# EAGLE design RFID_Reader_v0.1 (EAGLE 9.6.2)
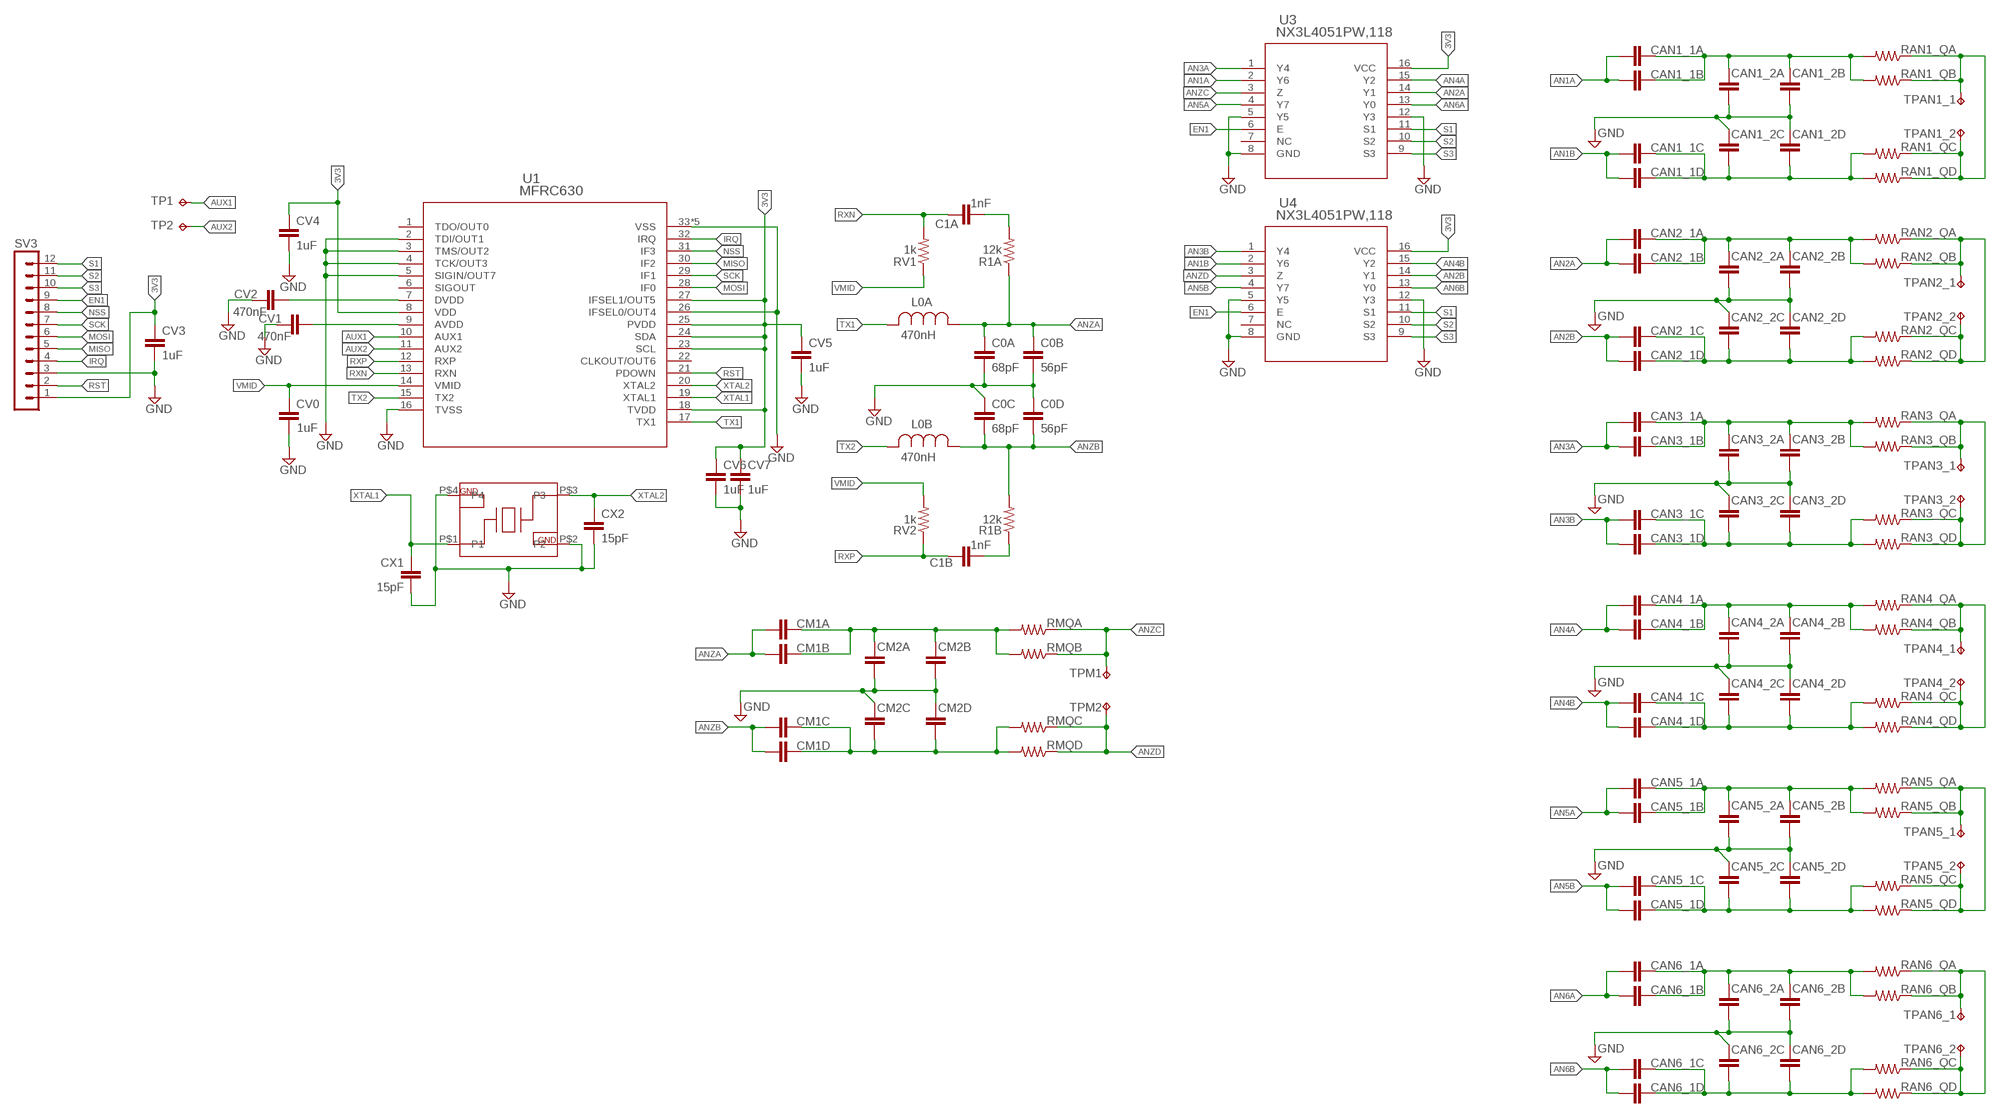
[diagram p0: schematic, sheet 1]

## Parts
C0A  68pF  C-EUC0805  [C0805]
C0B  56pF  C-EUC0805  [C0805]
C0C  68pF  C-EUC0805  [C0805]
C0D  56pF  C-EUC0805  [C0805]
C1A  1nF  C-EUC0805  [C0805]
C1B  1nF  C-EUC0805  [C0805]
CAN1_1A  C-EUC0805  [C0805]
CAN1_1B  C-EUC0805  [C0805]
CAN1_1C  C-EUC0805  [C0805]
CAN1_1D  C-EUC0805  [C0805]
CAN1_2A  C-EUC0805  [C0805]
CAN1_2B  C-EUC0805  [C0805]
CAN1_2C  C-EUC0805  [C0805]
CAN1_2D  C-EUC0805  [C0805]
CAN2_1A  C-EUC0805  [C0805]
CAN2_1B  C-EUC0805  [C0805]
CAN2_1C  C-EUC0805  [C0805]
CAN2_1D  C-EUC0805  [C0805]
CAN2_2A  C-EUC0805  [C0805]
CAN2_2B  C-EUC0805  [C0805]
CAN2_2C  C-EUC0805  [C0805]
CAN2_2D  C-EUC0805  [C0805]
CAN3_1A  C-EUC0805  [C0805]
CAN3_1B  C-EUC0805  [C0805]
CAN3_1C  C-EUC0805  [C0805]
CAN3_1D  C-EUC0805  [C0805]
CAN3_2A  C-EUC0805  [C0805]
CAN3_2B  C-EUC0805  [C0805]
CAN3_2C  C-EUC0805  [C0805]
CAN3_2D  C-EUC0805  [C0805]
CAN4_1A  C-EUC0805  [C0805]
CAN4_1B  C-EUC0805  [C0805]
CAN4_1C  C-EUC0805  [C0805]
CAN4_1D  C-EUC0805  [C0805]
CAN4_2A  C-EUC0805  [C0805]
CAN4_2B  C-EUC0805  [C0805]
CAN4_2C  C-EUC0805  [C0805]
CAN4_2D  C-EUC0805  [C0805]
CAN5_1A  C-EUC0805  [C0805]
CAN5_1B  C-EUC0805  [C0805]
CAN5_1C  C-EUC0805  [C0805]
CAN5_1D  C-EUC0805  [C0805]
CAN5_2A  C-EUC0805  [C0805]
CAN5_2B  C-EUC0805  [C0805]
CAN5_2C  C-EUC0805  [C0805]
CAN5_2D  C-EUC0805  [C0805]
CAN6_1A  C-EUC0805  [C0805]
CAN6_1B  C-EUC0805  [C0805]
CAN6_1C  C-EUC0805  [C0805]
CAN6_1D  C-EUC0805  [C0805]
CAN6_2A  C-EUC0805  [C0805]
CAN6_2B  C-EUC0805  [C0805]
CAN6_2C  C-EUC0805  [C0805]
CAN6_2D  C-EUC0805  [C0805]
CM1A  C-EUC0805  [C0805]
CM1B  C-EUC0805  [C0805]
CM1C  C-EUC0805  [C0805]
CM1D  C-EUC0805  [C0805]
CM2A  C-EUC0805  [C0805]
CM2B  C-EUC0805  [C0805]
CM2C  C-EUC0805  [C0805]
CM2D  C-EUC0805  [C0805]
CV0  1uF  C-EUC0402  [C0402]
CV1  470nF  C-EUC0402  [C0402]
CV2  470nF  C-EUC0402  [C0402]
CV3  1uF  C-EUC0402  [C0402]
CV4  1uF  C-EUC0402  [C0402]
CV5  1uF  C-EUC0402  [C0402]
CV6  1uF  C-EUC0402  [C0402]
CV7  1uF  C-EUC0402  [C0402]
CX1  15pF  C-EUC0402  [C0402]
CX2  15pF  C-EUC0402  [C0402]
L0A  470nH  CE201210-R47JIND_BOURNS_CE201210_C  [IND_BOURNS_CE201210_C]
L0B  470nH  CE201210-R47JIND_BOURNS_CE201210_C  [IND_BOURNS_CE201210_C]
R1A  12k  R-US_R0805  [R0805]
R1B  12k  R-US_R0805  [R0805]
RAN1_QA  R-US_R0805  [R0805]
RAN1_QB  R-US_R0805  [R0805]
RAN1_QC  R-US_R0805  [R0805]
RAN1_QD  R-US_R0805  [R0805]
RAN2_QA  R-US_R0805  [R0805]
RAN2_QB  R-US_R0805  [R0805]
RAN2_QC  R-US_R0805  [R0805]
RAN2_QD  R-US_R0805  [R0805]
RAN3_QA  R-US_R0805  [R0805]
RAN3_QB  R-US_R0805  [R0805]
RAN3_QC  R-US_R0805  [R0805]
RAN3_QD  R-US_R0805  [R0805]
RAN4_QA  R-US_R0805  [R0805]
RAN4_QB  R-US_R0805  [R0805]
RAN4_QC  R-US_R0805  [R0805]
RAN4_QD  R-US_R0805  [R0805]
RAN5_QA  R-US_R0805  [R0805]
RAN5_QB  R-US_R0805  [R0805]
RAN5_QC  R-US_R0805  [R0805]
RAN5_QD  R-US_R0805  [R0805]
RAN6_QA  R-US_R0805  [R0805]
RAN6_QB  R-US_R0805  [R0805]
RAN6_QC  R-US_R0805  [R0805]
RAN6_QD  R-US_R0805  [R0805]
RMQA  R-US_R0805  [R0805]
RMQB  R-US_R0805  [R0805]
RMQC  R-US_R0805  [R0805]
RMQD  R-US_R0805  [R0805]
RV1  1k  R-US_R0805  [R0805]
RV2  1k  R-US_R0805  [R0805]
SV3  MA12-1  [MA12-1]
TP1  TPTP10R  [TP10R]
TP2  TPTP10R  [TP10R]
TPAN1_1  TPTP10R  [TP10R]
TPAN1_2  TPTP10R  [TP10R]
TPAN2_1  TPTP10R  [TP10R]
TPAN2_2  TPTP10R  [TP10R]
TPAN3_1  TPTP10R  [TP10R]
TPAN3_2  TPTP10R  [TP10R]
TPAN4_1  TPTP10R  [TP10R]
TPAN4_2  TPTP10R  [TP10R]
TPAN5_1  TPTP10R  [TP10R]
TPAN5_2  TPTP10R  [TP10R]
TPAN6_1  TPTP10R  [TP10R]
TPAN6_2  TPTP10R  [TP10R]
TPM1  TPTP10R  [TP10R]
TPM2  TPTP10R  [TP10R]
U1  MFRC630  MFRC63002HN,118HVQFN32_SOT617-1_NXP-M  [HVQFN32_SOT617-1_NXP-M]
U2  E3SB27  E3SB27E0X000VEE3SB27E0X000VE  [DFN320X250X75-4N]
U3  NX3L4051PW,118  NX3L4051PW,118TSSOP16_NXP-M  [TSSOP16_NXP-M]
U4  NX3L4051PW,118  NX3L4051PW,118TSSOP16_NXP-M  [TSSOP16_NXP-M]

## Nets
3V3: CV3.1 CV4.1 CV5.1 CV6.1 CV7.1 SV3.1 U1.8(VDD) U1.18(TVDD) U1.23(SCL) U1.24(SDA) U1.25(PVDD) U1.27(IFSEL1/OUT5) U3.16(VCC) U4.16(VCC)
AN1A: CAN1_1A.2 CAN1_1B.2 U3.2(Y6)
AN1B: CAN1_1C.2 CAN1_1D.2 U4.2(Y6)
AN2A: CAN2_1A.2 CAN2_1B.2 U3.14(Y1)
AN2B: CAN2_1C.2 CAN2_1D.2 U4.14(Y1)
AN3A: CAN3_1A.2 CAN3_1B.2 U3.1(Y4)
AN3B: CAN3_1C.2 CAN3_1D.2 U4.1(Y4)
AN4A: CAN4_1A.2 CAN4_1B.2 U3.15(Y2)
AN4B: CAN4_1C.2 CAN4_1D.2 U4.15(Y2)
AN5A: CAN5_1A.2 CAN5_1B.2 U3.4(Y7)
AN5B: CAN5_1C.2 CAN5_1D.2 U4.4(Y7)
AN6A: CAN6_1A.2 CAN6_1B.2 U3.13(Y0)
AN6B: CAN6_1C.2 CAN6_1D.2 U4.13(Y0)
ANZA: C0A.1 C0B.1 CM1A.2 CM1B.2 L0A.1 R1A.1
ANZB: C0C.2 C0D.2 CM1C.2 CM1D.2 L0B.1 R1B.2
ANZC: RMQA.1 RMQB.1 TPM1.TP U3.3(Z)
ANZD: RMQC.1 RMQD.1 TPM2.TP U4.3(Z)
AUX1: TP1.TP U1.10(AUX1)
AUX2: TP2.TP U1.11(AUX2)
EN1: SV3.9 U3.6(E) U4.6(E)
GND: C0A.2 C0B.2 C0C.1 C0D.1 CAN1_2A.2 CAN1_2B.2 CAN1_2C.1 CAN1_2D.1 CAN2_2A.2 CAN2_2B.2 CAN2_2C.1 CAN2_2D.1 CAN3_2A.2 CAN3_2B.2 CAN3_2C.1 CAN3_2D.1 CAN4_2A.2 CAN4_2B.2 CAN4_2C.1 CAN4_2D.1 CAN5_2A.2 CAN5_2B.2 CAN5_2C.1 CAN5_2D.1 CAN6_2A.2 CAN6_2B.2 CAN6_2C.1 CAN6_2D.1 CM2A.2 CM2B.2 CM2C.1 CM2D.1 CV0.2 CV1.2 CV2.2 CV3.2 CV4.2 CV5.2 CV6.2 CV7.2 CX1.2 CX2.2 SV3.3 U1.2(TDI/OUT1) U1.3(TMS/OUT2) U1.4(TCK/OUT3) U1.5(SIGIN/OUT7) U1.16(TVSS) U1.26(IFSEL0/OUT4) U1.33(VSS) U1.P$1(VSS) U1.P$2(VSS) U1.P$3(VSS) U1.P$4(VSS) U2.P$2(P2) U2.P$4(P4) U3.5(Y5) U3.8(GND) U3.12(Y3) U4.5(Y5) U4.8(GND) U4.12(Y3)
IRQ: SV3.4 U1.32(IRQ)
MISO: SV3.5 U1.30(IF2)
MOSI: SV3.6 U1.28(IF0)
N$1: CM1C.1 CM1D.1 CM2C.2 CM2D.2 RMQC.2 RMQD.2
N$2: C1A.2 R1A.2
N$3: CM1A.1 CM1B.1 CM2A.1 CM2B.1 RMQA.2 RMQB.2
N$4: CAN2_1C.1 CAN2_1D.1 CAN2_2C.2 CAN2_2D.2 RAN2_QC.2 RAN2_QD.2
N$5: CAN2_1A.1 CAN2_1B.1 CAN2_2A.1 CAN2_2B.1 RAN2_QA.2 RAN2_QB.2
N$6: RAN2_QA.1 RAN2_QB.1 RAN2_QC.1 RAN2_QD.1 TPAN2_1.TP TPAN2_2.TP
N$7: CAN1_1C.1 CAN1_1D.1 CAN1_2C.2 CAN1_2D.2 RAN1_QC.2 RAN1_QD.2
N$8: CAN1_1A.1 CAN1_1B.1 CAN1_2A.1 CAN1_2B.1 RAN1_QA.2 RAN1_QB.2
N$9: RAN1_QA.1 RAN1_QB.1 RAN1_QC.1 RAN1_QD.1 TPAN1_1.TP TPAN1_2.TP
N$10: CAN3_1C.1 CAN3_1D.1 CAN3_2C.2 CAN3_2D.2 RAN3_QC.2 RAN3_QD.2
N$11: CAN3_1A.1 CAN3_1B.1 CAN3_2A.1 CAN3_2B.1 RAN3_QA.2 RAN3_QB.2
N$12: RAN3_QA.1 RAN3_QB.1 RAN3_QC.1 RAN3_QD.1 TPAN3_1.TP TPAN3_2.TP
N$13: CAN4_1C.1 CAN4_1D.1 CAN4_2C.2 CAN4_2D.2 RAN4_QC.2 RAN4_QD.2
N$14: CAN4_1A.1 CAN4_1B.1 CAN4_2A.1 CAN4_2B.1 RAN4_QA.2 RAN4_QB.2
N$15: RAN4_QA.1 RAN4_QB.1 RAN4_QC.1 RAN4_QD.1 TPAN4_1.TP TPAN4_2.TP
N$16: CAN5_1C.1 CAN5_1D.1 CAN5_2C.2 CAN5_2D.2 RAN5_QC.2 RAN5_QD.2
N$17: CAN5_1A.1 CAN5_1B.1 CAN5_2A.1 CAN5_2B.1 RAN5_QA.2 RAN5_QB.2
N$19: C1B.2 R1B.1
N$21: RAN5_QA.1 RAN5_QB.1 RAN5_QC.1 RAN5_QD.1 TPAN5_1.TP TPAN5_2.TP
N$22: CAN6_1C.1 CAN6_1D.1 CAN6_2C.2 CAN6_2D.2 RAN6_QC.2 RAN6_QD.2
N$23: CAN6_1A.1 CAN6_1B.1 CAN6_2A.1 CAN6_2B.1 RAN6_QA.2 RAN6_QB.2
N$24: RAN6_QA.1 RAN6_QB.1 RAN6_QC.1 RAN6_QD.1 TPAN6_1.TP TPAN6_2.TP
N$26: CV2.1 U1.7(DVDD)
N$28: CV1.1 U1.9(AVDD)
NSS: SV3.8 U1.31(IF3)
RST: SV3.2 U1.21(PDOWN)
RXN: C1A.1 RV1.2 U1.13(RXN)
RXP: C1B.1 RV2.1 U1.12(RXP)
S1: SV3.12 U3.11(S1) U4.11(S1)
S2: SV3.11 U3.10(S2) U4.10(S2)
S3: SV3.10 U3.9(S3) U4.9(S3)
SCK: SV3.7 U1.29(IF1)
TX1: L0A.2 U1.17(TX1)
TX2: L0B.2 U1.15(TX2)
VMID: CV0.1 RV1.1 RV2.2 U1.14(VMID)
XTAL1: CX1.1 U1.19(XTAL1) U2.P$1(P1)
XTAL2: CX2.1 U1.20(XTAL2) U2.P$3(P3)
Unconnected: U1.1(TDO/OUT0) U1.6(SIGOUT) U1.22(CLKOUT/OUT6) U3.7(NC) U4.7(NC)

## Library data of the parts
C0A C0B C0C C0D C1A C1B CAN1_1A CAN1_1B CAN1_1C CAN1_1D CAN1_2A CAN1_2B CAN1_2C CAN1_2D CAN2_1A CAN2_1B CAN2_1C CAN2_1D CAN2_2A CAN2_2B CAN2_2C CAN2_2D CAN3_1A CAN3_1B CAN3_1C CAN3_1D CAN3_2A CAN3_2B CAN3_2C CAN3_2D CAN4_1A CAN4_1B CAN4_1C CAN4_1D CAN4_2A CAN4_2B CAN4_2C CAN4_2D CAN5_1A CAN5_1B CAN5_1C CAN5_1D CAN5_2A CAN5_2B CAN5_2C CAN5_2D CAN6_1A CAN6_1B CAN6_1C CAN6_1D CAN6_2A CAN6_2B CAN6_2C CAN6_2D CM1A CM1B CM1C CM1D CM2A CM2B CM2C CM2D CV0 CV1-CV7 CX1 CX2 = rcl:C-EU: CAPACITOR, European symbol; SPICEPREFIX: C
L0A L0B = CE201210-R47J:CE201210-R47J; COPYRIGHT: Copyright (C) 2024 Ultra Librarian. All rights reserved.; MANUFACTURER_PART_NUMBER: CE201210-R47J; MFR_NAME: Bourns Electronics
R1A R1B RAN1_QA RAN1_QB RAN1_QC RAN1_QD RAN2_QA RAN2_QB RAN2_QC RAN2_QD RAN3_QA RAN3_QB RAN3_QC RAN3_QD RAN4_QA RAN4_QB RAN4_QC RAN4_QD RAN5_QA RAN5_QB RAN5_QC RAN5_QD RAN6_QA RAN6_QB RAN6_QC RAN6_QD RMQA RMQB RMQC RMQD RV1 RV2 = rcl:R-US_: RESISTOR, American symbol; SPICEPREFIX: R
SV3 = con-lstb:MA12-1: PIN HEADER; OC_FARNELL: unknown; OC_NEWARK: unknown
TP1 TP2 TPAN1_1 TPAN1_2 TPAN2_1 TPAN2_2 TPAN3_1 TPAN3_2 TPAN4_1 TPAN4_2 TPAN5_1 TPAN5_2 TPAN6_1 TPAN6_2 TPM1 TPM2 = testpad:TP: Test pad
U1 = MFRC630:MFRC63002HN,118; COPYRIGHT: Copyright (C) 2024 Ultra Librarian. All rights reserved.; MANUFACTURER_PART_NUMBER: MFRC63002HN,118; MFR_NAME: NXP
U2 = E3SB27E0X000VE:E3SB27E0X000VE
U3 U4 = NX3L4051PW,118:NX3L4051PW,118; COPYRIGHT: Copyright (C) 2024 Ultra Librarian. All rights reserved.; MANUFACTURER_PART_NUMBER: NX3L4051PW,118; MFR_NAME: NXP

## Board
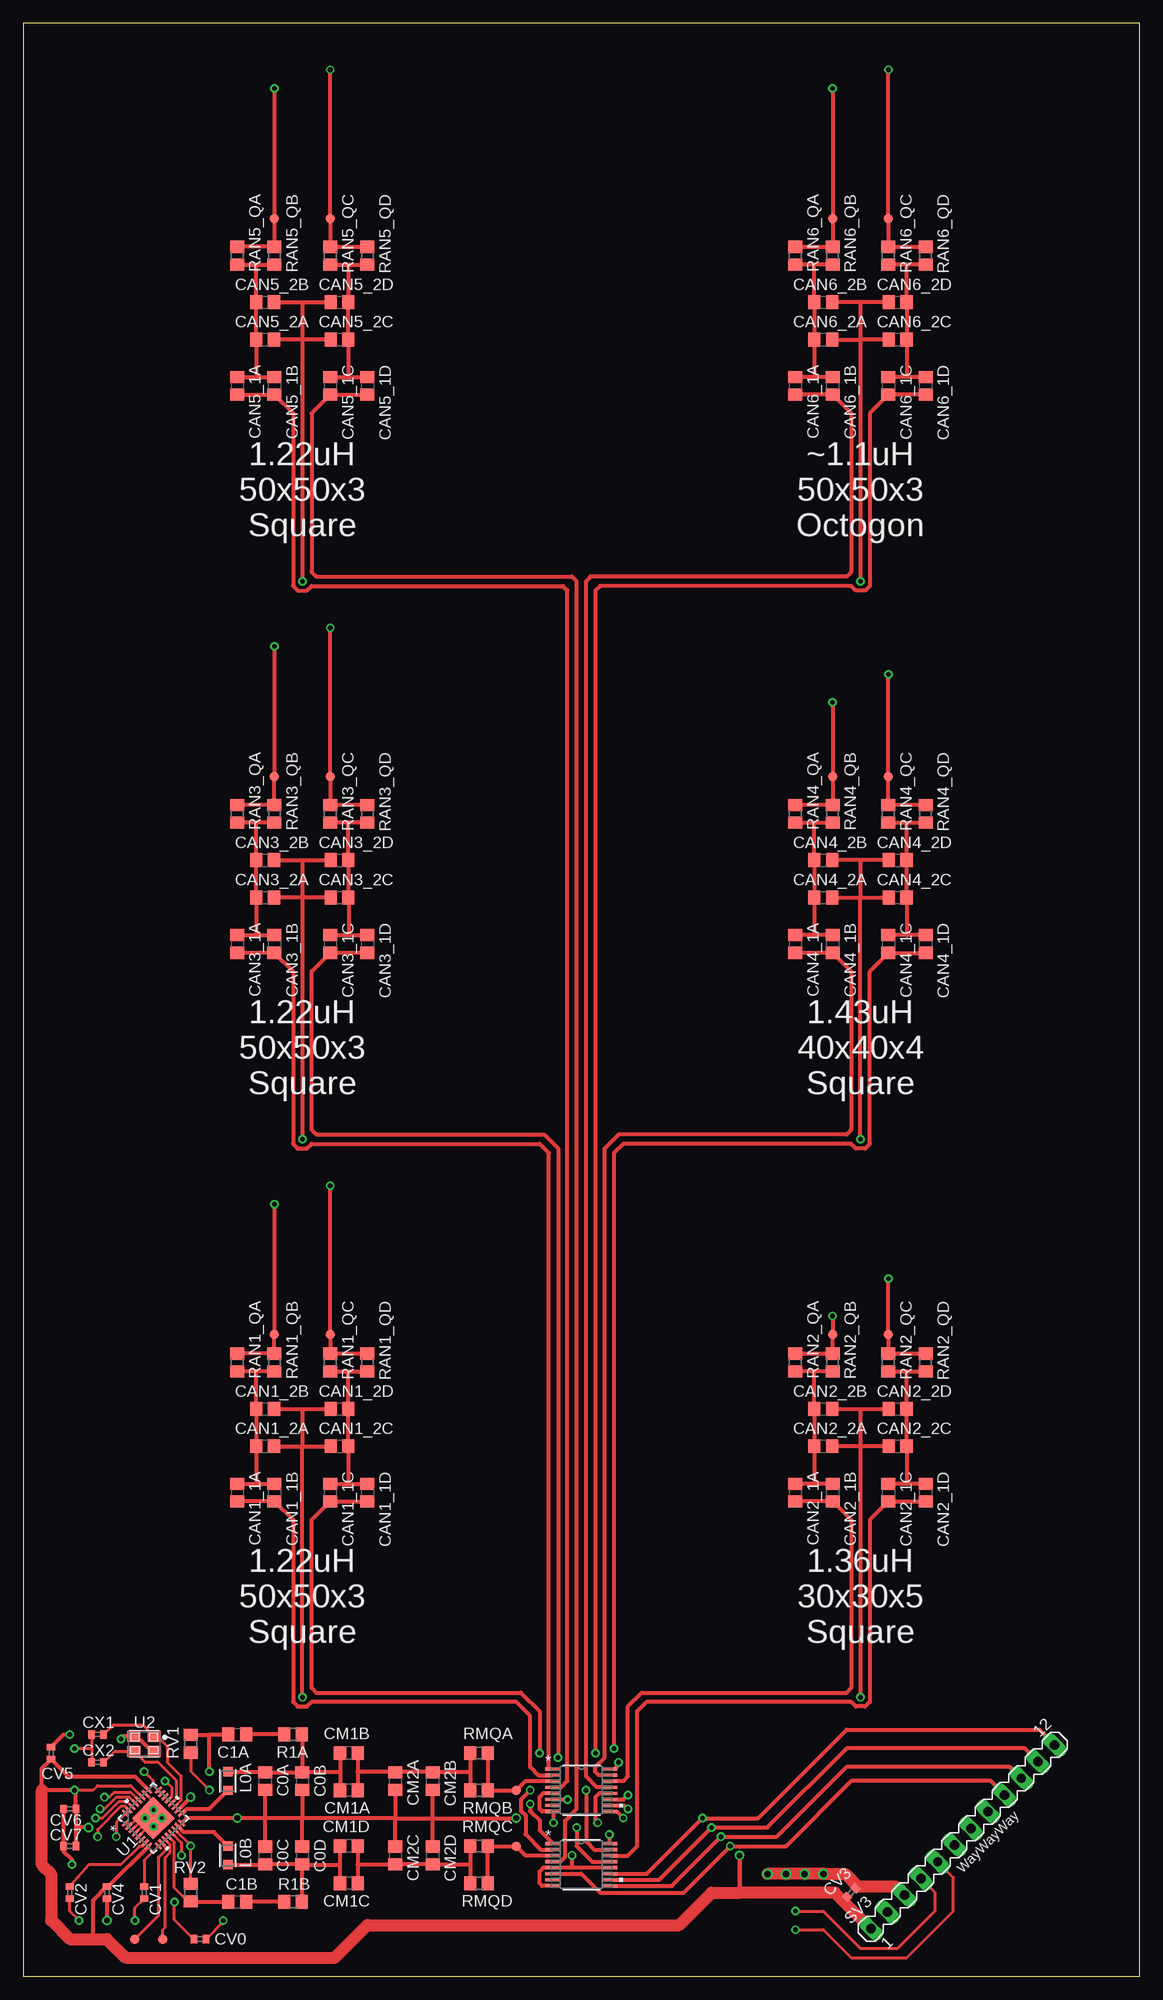
[diagram p1: board, top side]
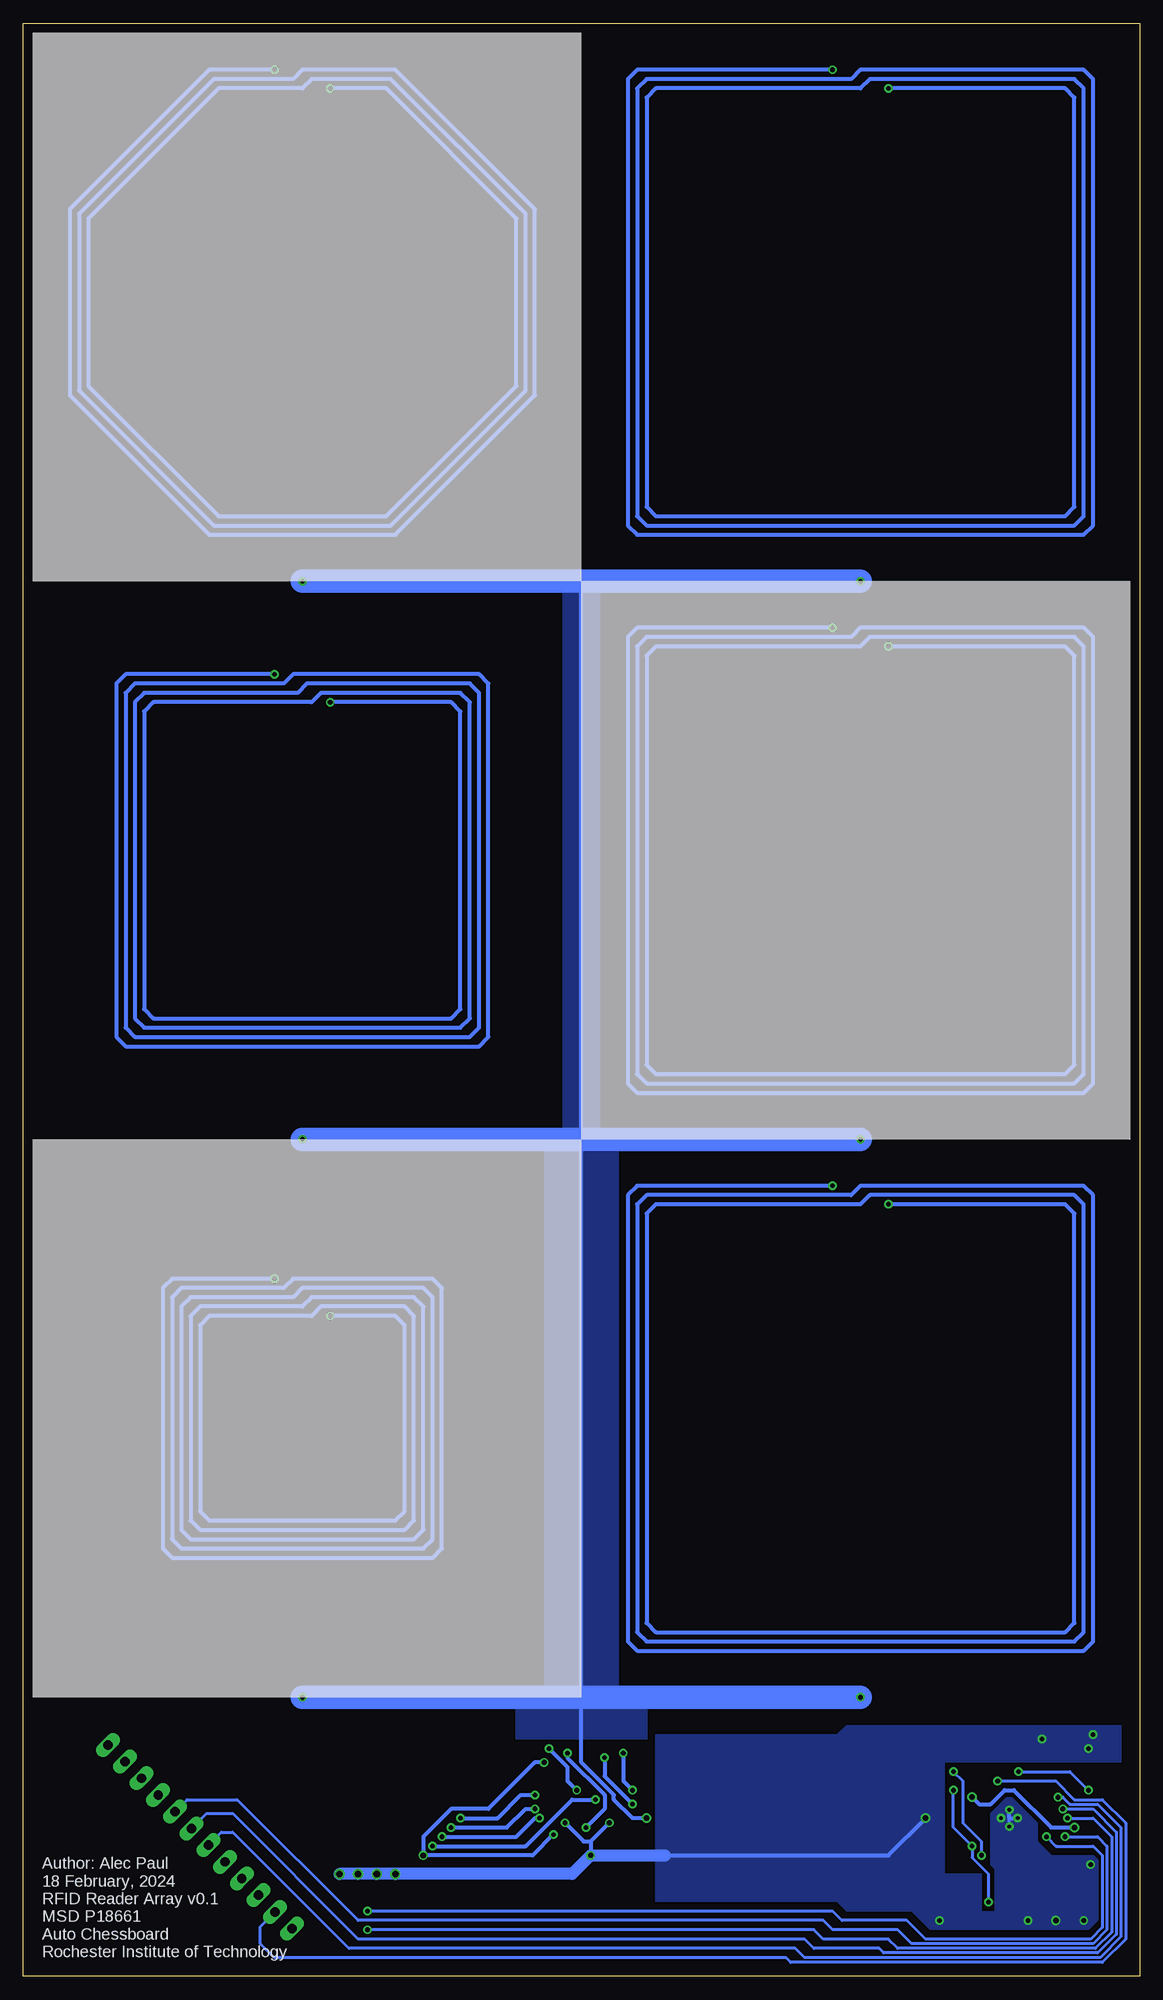
[diagram p2: board, bottom side, seen from below]

Size 120 x 210 mm. Coordinates in mm from the lower left corner, seen from the top.
Outline: 0,0 120,0 120,210 0,210 0,0
Copper layers (1*16): Top 0.035mm / dielectric 1.5mm / Bottom 0.035mm
Design rules "default *": minimum track width 4mil, minimum drill 0.35mm, track to track 4mil, track to pad 4mil, pad to pad 4mil, via to via 4mil, smd to smd 4mil, copper to edge 40mil, drill to drill 6mil, minimum pad ring 10mil, minimum via ring 8mil, stop-mask expansion 4mil, vias tented up to drill 0mil, thermal gap 10mil

### Footprints (pad centres in the part's own frame; a part is rotated, then mirrored left to right if it is on the bottom)
C0805 = smd 1.3 x 1.5: 1 -0.95,0; 2 0.95,0
C0402 = smd 0.7 x 0.9: 1 -0.65,0; 2 0.65,0
IND_BOURNS_CE201210_C = smd 1.003 x 0.991: 1 -0.997,0; 2 0.997,0
R0805 = smd 1.3 x 1.5: 1 -0.95,0; 2 0.95,0
MA12-1 = drill 1.016 long: 1 -13.97,0; 2 -11.43,0; 3 -8.89,0; 4 -6.35,0; 5 -3.81,0; 6 -1.27,0; 7 1.27,0; 8 3.81,0; 9 6.35,0; 10 8.89,0; 11 11.43,0; 12 13.97,0
TP10R = smd 1 x 1: TP 0,0
HVQFN32_SOT617-1_NXP-M = smd 0.914 x 0.254: 1 -2.502,1.75; 2 -2.502,1.25; 3 -2.502,0.75; 4 -2.502,0.25; 5 -2.502,-0.25; 6 -2.502,-0.75; 7 -2.502,-1.25; 8 -2.502,-1.75; 17 2.502,-1.75; 18 2.502,-1.25; 19 2.502,-0.75; 20 2.502,-0.25; 21 2.502,0.25; 22 2.502,0.75; 23 2.502,1.25; 24 2.502,1.75 | smd 0.254 x 0.914: 9 -1.75,-2.502; 10 -1.25,-2.502; 11 -0.75,-2.502; 12 -0.25,-2.502; 13 0.25,-2.502; 14 0.75,-2.502; 15 1.25,-2.502; 16 1.75,-2.502; 25 1.75,2.502; 26 1.25,2.502; 27 0.75,2.502; 28 0.25,2.502; 29 -0.25,2.502; 30 -0.75,2.502; 31 -1.25,2.502; 32 -1.75,2.502 | smd 3.251 x 3.251: 33 0,0 | drill 0.4: P$1 -0.635,0.635; P$2 0.635,0.635; P$3 -0.635,-0.635; P$4 0.635,-0.635
DFN320X250X75-4N = smd 1.4 x 1.2: P$1 -1.1,-0.8; P$2 1.1,-0.8; P$3 1.1,0.8; P$4 -1.1,0.8
TSSOP16_NXP-M = smd 1.613 x 0.356: 1 -3.054,2.275; 2 -3.054,1.625; 3 -3.054,0.975; 4 -3.054,0.325; 5 -3.054,-0.325; 6 -3.054,-0.975; 7 -3.054,-1.625; 8 -3.054,-2.275; 9 3.054,-2.275; 10 3.054,-1.625; 11 3.054,-0.975; 12 3.054,-0.325; 13 3.054,0.325; 14 3.054,0.975; 15 3.054,1.625; 16 3.054,2.275

### Placement (x,y rotation side)
C0A  26,21 270 top
C0B  30,21 270 top
C0C  26,13 270 top
C0D  30,13 270 top
C1A  23,26 0 top
C1B  23,8 0 top
CAN1_1A  23,52 270 top
CAN1_1B  27,52 270 top
CAN1_1C  33,52 270 top
CAN1_1D  37,52 270 top
CAN1_2A  26,57 0 top
CAN1_2B  26,61 0 top
CAN1_2C  34,57 0 top
CAN1_2D  34,61 0 top
CAN2_1A  83,52 270 top
CAN2_1B  87,52 270 top
CAN2_1C  93,52 270 top
CAN2_1D  97,52 270 top
CAN2_2A  86,57 0 top
CAN2_2B  86,61 0 top
CAN2_2C  94,57 0 top
CAN2_2D  94,61 0 top
CAN3_1A  23,111 270 top
CAN3_1B  27,111 270 top
CAN3_1C  33,111 270 top
CAN3_1D  37,111 270 top
CAN3_2A  26,116 0 top
CAN3_2B  26,120 0 top
CAN3_2C  34,116 0 top
CAN3_2D  34,120 0 top
CAN4_1A  83,111 270 top
CAN4_1B  87,111 270 top
CAN4_1C  93,111 270 top
CAN4_1D  97,111 270 top
CAN4_2A  86,116 0 top
CAN4_2B  86,120 0 top
CAN4_2C  94,116 0 top
CAN4_2D  94,120 0 top
CAN5_1A  23,171 270 top
CAN5_1B  27,171 270 top
CAN5_1C  33,171 270 top
CAN5_1D  37,171 270 top
CAN5_2A  26,176 0 top
CAN5_2B  26,180 0 top
CAN5_2C  34,176 0 top
CAN5_2D  34,180 0 top
CAN6_1A  83,171 270 top
CAN6_1B  87,171 270 top
CAN6_1C  93,171 270 top
CAN6_1D  97,171 270 top
CAN6_2A  86,176 0 top
CAN6_2B  86,180 0 top
CAN6_2C  94,176 0 top
CAN6_2D  94,180 0 top
CM1A  35,20 180 top
CM1B  35,24 180 top
CM1C  35,10 180 top
CM1D  35,14 180 top
CM2A  40,21 270 top
CM2B  44,21 270 top
CM2C  40,13 270 top
CM2D  44,13 270 top
CV0  19,4 0 top
CV1  13,9 270 top
CV2  5,9 270 top
CV3  89,9 45 top
CV4  9,9 270 top
CV5  3,24 90 top
CV6  5,18 180 top
CV7  5,14 180 top
CX1  8,26 180 top
CX2  8,23 180 top
L0A  22,21 270 top
L0B  22,13 90 top
R1A  29,26 180 top
R1B  29,8 0 top
RAN1_QA  23,66 270 top
RAN1_QB  27,66 270 top
RAN1_QC  33,66 270 top
RAN1_QD  37,66 270 top
RAN2_QA  83,66 270 top
RAN2_QB  87,66 270 top
RAN2_QC  93,66 270 top
RAN2_QD  97,66 270 top
RAN3_QA  23,125 270 top
RAN3_QB  27,125 270 top
RAN3_QC  33,125 270 top
RAN3_QD  37,125 270 top
RAN4_QA  83,125 270 top
RAN4_QB  87,125 270 top
RAN4_QC  93,125 270 top
RAN4_QD  97,125 270 top
RAN5_QA  23,185 270 top
RAN5_QB  27,185 270 top
RAN5_QC  33,185 270 top
RAN5_QD  37,185 270 top
RAN6_QA  83,185 270 top
RAN6_QB  87,185 270 top
RAN6_QC  93,185 270 top
RAN6_QD  97,185 270 top
RMQA  49,24 180 top
RMQB  49,20 180 top
RMQC  49,14 180 top
RMQD  49,10 180 top
RV1  18,25 90 top
RV2  18,9 90 top
SV3  101,15 45 top
TP1  12,4 0 top
TP2  15,4 0 top
TPAN1_1  27,69 0 top
TPAN1_2  33,69 0 top
TPAN2_1  87,69 0 top
TPAN2_2  93,69 0 top
TPAN3_1  27,129 0 top
TPAN3_2  33,129 0 top
TPAN4_1  87,129 0 top
TPAN4_2  93,129 0 top
TPAN5_1  27,189 0 top
TPAN5_2  33,189 0 top
TPAN6_1  87,189 0 top
TPAN6_2  93,189 0 top
TPM1  53,20 270 top
TPM2  53,14 270 top
U1  14,17 45 top
U2  13,25 180 top
U3  60,20 0 top
U4  60,12 0 top

### Tracks (layer width: path | path; a pad name or v marks a point on that pad's centre or on a via)
3V3  (via drill 0.5, 0.6)
  Top 0.305: v5.5,20 7.5,20 8,20.5 11.56,20.5 U1.27 | v13,22 14,21 14,20.54 U1.24 U1.23 | U3.16 63.52,22.27
  Top 0.406: U4.16 63.05,15.2 v63,15.25 | 63.52,22.27 64,22.75 v64,23 | U1.25 11.99,21.49 4.86,21.49 CV5.1 2,22.35 2,20 v5.5,20 5.65,19.85 CV6.1 5.65,16 | U1.18 18,19.23 v18,19.25 | 7.5,4 7.5,8.15 CV4.1 9.12,9.65 U1.8 | 5.65,16 CV7.1 | v7,16 5.65,16
  Top 0.508: v77,13 77,9
  Top 0.813: CV3.1 88.12,8.12
  Top 1.27: 2,20 2,12 3,11 3,6 5,4 7.5,4 9,4 11,2 33.5,2 37,5.5 70.5,5.5 74,9 77,9 87.24,9 88.12,8.12 SV3.1
  Bottom 0.305: v13,22 7.5,22 v5.5,20
  Bottom 0.406: v63,15.25 65.25,13 v77,13 77,15 74,18 70,18 65,23 v64,23 | v18,19.25 17.25,18.5 16,18.5 14.5,20 13.5,20 9.5,16 v7,16
AN1A
  Top 0.406: CAN1_1A.2 CAN1_1B.2 29,49.05 29,29.5 29.5,29 30.5,29 31,29.5 53,29.5 54.5,28 54.5,22.5 55.38,21.62 U3.2
AN1B  (via drill 0.5)
  Top 0.406: CAN1_1D.2 CAN1_1C.2 31,49.05 31,31 31.5,30.5 53.5,30.5 55.5,28.5 v55.5,24 | U4.2 55.62,13.62 53.99,15.26 53.99,17.29 53.5,17.78 53.5,19 v54.5,20
  Bottom 0.406: v55.5,24 55.5,21 v54.5,20
AN2A
  Top 0.406: CAN2_1A.2 CAN2_1B.2 89,49.05 89,31 88.5,30.5 66.5,30.5 65,29 65,21.5 64.47,20.98 U3.14
AN2B
  Top 0.406: CAN2_1D.2 CAN2_1C.2 91,49.05 91,29.5 90.5,29 89.5,29 89,29.5 67,29.5 66,28.5 66,14 64.97,12.97 U4.14
AN3A
  Top 0.406: CAN3_1A.2 CAN3_1B.2 29,108.05 29,89.5 29.5,89 30.5,89 31,89.5 55.5,89.5 56.5,88.5 56.5,22.5 56.73,22.27 U3.1
AN3B  (via drill 0.5)
  Top 0.406: CAN3_1D.2 CAN3_1C.2 31,108.05 31,91 31.5,90.5 56,90.5 57.5,89 v57.5,23.5 | U4.1 55.5,15.72 55.5,16.75 54.5,17.75 v54.5,18.5
  Bottom 0.406: v57.5,23.5 57.5,21.5 v54.5,18.5
AN4A
  Top 0.406: CAN4_1A.2 CAN4_1B.2 89,108.05 89,91 88.5,90.5 64,90.5 62.5,89 62.5,23.5 61.5,22.5 61.5,22 61.88,21.62 U3.15
AN4B  (via drill 0.5)
  Top 0.406: CAN4_1D.2 CAN4_1C.2 91,108.05 91,89.5 90.5,89 89.5,89 89,89.5 64.5,89.5 63.5,88.5 v63.5,24.5 | U4.15 61.38,13.62 60.5,14.5 v60.5,20
  Bottom 0.406: v63.5,24.5 61.5,22.5 61.5,21 v60.5,20
AN5A
  Top 0.406: CAN5_1A.2 CAN5_1B.2 29,168.05 29,149.5 29.5,149 30.5,149 31,149.5 58,149.5 58.5,149 58.5,21 57.83,20.32 U3.4
AN5B
  Top 0.406: CAN5_1D.2 CAN5_1C.2 31,168.05 31,151 31.5,150.5 59,150.5 59.5,150 59.5,18 58.24,16.74 58.24,12.86 57.71,12.32 U4.4
AN6A
  Top 0.406: CAN6_1A.2 CAN6_1B.2 89,168.05 89,151 88.5,150.5 61,150.5 60.5,150 60.5,21.5 61.67,20.32 U3.13
AN6B  (via drill 0.5)
  Top 0.406: CAN6_1D.2 CAN6_1C.2 91,168.05 91,149.5 90.5,149 89.5,149 89,149.5 62,149.5 61.5,149 v61.5,24 | U4.13 61.17,12.32 59.5,14 v59.5,16
  Bottom 0.406: v61.5,24 61.5,23.5 57.5,19.5 57.5,18 v59.5,16
ANZA
  Top 0.406: CM1B.2 34.05,22 | 34.05,22 CM1A.2 | 34.05,22 30.05,22 C0B.1 | R1A.1 30,25.95 C0B.1 | L0A.1 25.95,22 C0A.1 C0B.1
ANZB
  Top 0.406: CM1C.2 34.05,12 | 34.05,12 CM1D.2 | C0D.2 C0C.2 25.95,12 L0B.1 | C0D.2 30.05,12 34.05,12 | R1B.2 30,8.05 C0D.2
ANZC
  Top 0.406: RMQA.1 RMQB.1 TPM1.TP 53.98,20.98 U3.3
ANZD
  Top 0.406: RMQD.1 RMQC.1 TPM2.TP 54.02,12.97 U4.3
AUX1
  Top 0.305: U1.10 15.25,13.98 15.25,13.5 14.5,12.75 14.5,6.5 TP1.TP
AUX2
  Top 0.305: U1.11 15.75,14.19 15.75,13.25 15.25,12.75 15.25,5.25 15,5 TP2.TP
EN1  (via drill 0.5)
  Top 0.406: U4.6 59.98,11.03 62,9 71,9 v76,14 82,14 89,21 103.98,21 | U3.6 58.48,19.02 v58.5,19 | SV3.9 103.98,21 | 103.98,21
  Bottom 0.406: v76,14 66,14 61,19 v58.5,19
GND  (via drill 0.5, 0.5 pad 0.55, 0.6, 0.7)
  Top 0.305: U1.16 17.12,16.58 | U1.26 14,18.77 U1.P$2 | U1.5 13.46,16.1 U1.P$3 | U1.2 12.23,17 U1.P$1 | U1.3 12.94,17 U1.P$1 | U1.4 13.1,16.46 U1.P$1 | v6,6 5,7 CV2.2 | v12,6 12,7.35 CV1.2 | CX1.2 7.35,24.5 | 7.35,24.5 CX2.2 | v5.5,24.5 7.35,24.5 | CV0.2 21.5,5.85 v21.5,6
  Top 0.406: CAN3_2C.1 30,116 | 30,116 CAN3_2A.2 | CAN3_2B.2 30,120 | 30,120 CAN3_2D.1 | 30,120 30,116 | CAN4_2D.1 90,120 | 90,120 CAN4_2B.2 | CAN1_2B.2 30,61 | 30,61 CAN1_2D.1 | CAN2_2B.2 90,61 | 90,61 CAN2_2D.1 | 30,116 v30,90 | 90,120 90,116 | v90,90 90,116 | 30,61 30,57 | v30,30 30,57 | CM2D.1 44,17 | 44,17 CM2B.2 | CM2C.1 40,17 | CM2A.2 40,17 | 40,17 44,17 | C0D.1 30,17 | C0B.2 30,17 | 40,17 30,17 | C0C.1 26,17 | 26,17 C0A.2 | 30,17 26,17 | 26,17 v23,17 17.54,17 17.12,16.58 | 44,17 v53,17 | U3.5 55.92,19.68 55.5,19.25 55.5,18 55.77,17.73 U3.8 57,17.67 v57,16.5 | U4.8 55.77,9.72 55.5,10 55.5,11.25 55.92,11.68 U4.5 59,11.68 | U4.12 59,11.68 | CV4.2 v9,6 | U3.12 61.92,19.68 61.5,19.25 61.5,16.75 v61.75,16.5 | 59,11.68 v59,13 | U2.P$4 13.8,24.2 12.2,25.8 U2.P$2 10.8,25.8 v10.5,25.5 | CV6.2 CV7.2 4.35,13.4 5.25,12.5 v5.25,12 | CAN2_2C.1 90,57 | 90,57 CAN2_2A.2 | 90,61 90,57 | 90,57 v90,30 | CAN4_2A.2 90,116 | 90,116 CAN4_2C.1 | CAN1_2A.2 30,57 | 30,57 CAN1_2C.1 | U1.33 U1.P$2 | CAN5_2B.2 30,180 | 30,180 CAN5_2D.1 | CAN5_2C.1 30,176 | 30,176 CAN5_2A.2 | 30,180 30,176 | 30,176 v30,150 | CAN6_2A.2 90,176 | CAN6_2C.1 90,176 | CAN6_2D.1 90,180 | 90,180 CAN6_2B.2 | 90,180 90,176 | 90,176 v90,150 | CV5.2 4.35,26 v5,26
  Top 0.813: CV3.2 89.67,9.67 | 89.67,9.67
  Top 1.27: v80,11 v82,11 v84,11 v86,11 88.34,11 89.67,9.67 93.76,9.67 SV3.3
  Bottom 0.305: U1.P$3 U1.33
  Bottom 0.406: v57,16.5 59,14.5 | 59,14.5 v59,13 | v61.75,16.5 59.75,14.5 59,14.5 | U1.P$1 U1.33 U1.P$2 | 60,150 60,90 60,30 60,23 56.5,19.5 56.5,19 54.5,17 v53,17 | 51,13 27,13 v23,17
  Bottom 1.27: 51,13 v59,13 61,11 v80,11 v82,11 v84,11 v86,11
  Bottom 2.54: v30,90 60,90 v90,90 | v30,30 60,30 v90,30 | v30,150 60,150 v90,150
  pour Bottom: 64,90 64,30 56,30 56,90
  pour Bottom: 53,25.5 67,25.5 67,31 53,31
  pour Bottom (rank 2, no thermals): 2,27 2,23 21,23 21,11 17,11 17,7 15.5,7 15.5,11.5 16,12 16,17.5 14.25,19.25 13.75,19.25 11,16.5 11,14.5 9.5,13 5,13 4.5,12.5 4.5,6 5.5,5 22.5,5 24.5,7 31.5,7 32.5,8 52,8 52,26 32.5,26 31.5,27
  pour Bottom: 62,150 62,91 58,91 58,150
IRQ  (via drill 0.5)
  Top 0.305: U1.32 10,16.54 v10,15 | v83,7 86,7 90,3 94,3 98,7 98,9.02 | SV3.4 98,9.02 | 98,9.02
  Bottom 0.305: v10,15 9,14 5,14 4,13 4,5.25 5.25,4 23,4 25,6 32,6 33,7 46,7 v83,7
MISO  (via drill 0.5)
  Top 0.305: U1.30 11.19,18.75 10.25,18.75 8.5,17 v7.75,17 | v83,5 86,5 89,2 95,2 100,7 100,10.61 SV3.5 | SV3.5
  Bottom 0.305: v7.75,17 5,17 3,15 3,4.75 4.75,3 26,3 27,4 34,4 35,5 v83,5
MOSI  (via drill 0.5)
  Top 0.305: U1.28 11.6,19.75 9.75,19.75 9.25,19.25 v8.75,19.25
  Bottom 0.305: v8.75,19.25 8.25,19.25 7.5,18.5 4.5,18.5 2,16 2,4.25 4.25,2 36,2 37,3 85,3 97.5,15.5 98.7,15.5 | SV3.6 98.7,15.5 | 98.7,15.5
N$1
  Top 0.406: CM1D.1 35.95,12 | 35.95,12 CM1C.1 | 35.95,12 39.95,12 CM2C.2 CM2D.2 48,12.05 48.05,12 | RMQC.2 48.05,12 | 48.05,12 RMQD.2
N$2
  Top 0.406: R1A.2 C1A.2
N$3
  Top 0.406: CM1B.1 35.95,22 | 35.95,22 CM1A.1 | RMQA.2 48.05,22 | 48.05,22 RMQB.2 | CM2A.1 39.95,22 | 39.95,22 35.95,22 | 48.05,22 44.05,22 CM2B.1 43.95,22 39.95,22
N$4
  Top 0.406: CAN2_1D.1 95,52.95 | 95,52.95 CAN2_1C.1 | 95,52.95 94.95,53 CAN2_2C.2 CAN2_2D.2 94.95,65 95,65.05 | RAN2_QC.2 95,65.05 | 95,65.05 RAN2_QD.2
N$5
  Top 0.406: CAN2_1B.1 85,52.95 | 85,52.95 CAN2_1A.1 | 85,52.95 85.05,53 CAN2_2A.1 CAN2_2B.1 85.05,65 85,65.05 | RAN2_QB.2 85,65.05 | 85,65.05 RAN2_QA.2
N$6  (via drill 0.5)
  Top 0.406: RAN2_QA.1 RAN2_QB.1 TPAN2_1.TP v87,71 | RAN2_QD.1 RAN2_QC.1 TPAN2_2.TP v93,75
  Bottom 0.406: v93,75 104,75 105,74 105,46 104,45 76,45 75,46 75,74 76,75 91,75 92,74 103,74 104,73 104,47 103,46 77,46 76,47 76,73 77,74 90,74 91,73 102,73 103,72 103,48 102,47 78,47 77,48 77,72 78,73 89,73 90,72 101,72 102,71 102,49 101,48 79,48 78,49 78,71 79,72 88,72 89,71 100,71 101,70 101,50 100,49 80,49 79,50 79,70 80,71 v87,71
N$7
  Top 0.406: CAN1_1C.1 35,52.95 | 35,52.95 CAN1_1D.1 | 35,52.95 34.95,53 CAN1_2C.2 CAN1_2D.2 34.95,65 35,65.05 | RAN1_QC.2 35,65.05 | 35,65.05 RAN1_QD.2
N$8
  Top 0.406: CAN1_1A.1 25,52.95 | 25,52.95 CAN1_1B.1 | 25,52.95 25.05,53 CAN1_2A.1 CAN1_2B.1 25.05,65 25,65.05 | RAN1_QB.2 25,65.05 | 25,65.05 RAN1_QA.2
N$9  (via drill 0.5)
  Top 0.406: RAN1_QA.1 RAN1_QB.1 TPAN1_1.TP v27,83 | RAN1_QD.1 RAN1_QC.1 TPAN1_2.TP v33,85
  Bottom 0.406: v33,85 54,85 55,84 55,36 54,35 6,35 5,36 5,84 6,85 30,85 31,84 53,84 54,83 54,37 53,36 7,36 6,37 6,83 7,84 29,84 30,83 52,83 53,82 53,38 52,37 8,37 7,38 7,82 8,83 v27,83
N$10
  Top 0.406: RAN3_QD.2 35,124.05 | 35,124.05 RAN3_QC.2 | CAN3_1C.1 35,111.95 | 35,111.95 CAN3_1D.1 | 35,111.95 35,115.95 CAN3_2C.2 CAN3_2D.2 34.95,124 35,124.05
N$11
  Top 0.406: CAN3_1A.1 25,111.95 | 25,111.95 CAN3_1B.1 | RAN3_QB.2 25,124.05 | 25,124.05 RAN3_QA.2 | 25,111.95 25.05,112 CAN3_2A.1 CAN3_2B.1 25.05,124 25,124.05
N$12  (via drill 0.5)
  Top 0.406: RAN3_QA.1 RAN3_QB.1 TPAN3_1.TP v27,143 | RAN3_QD.1 RAN3_QC.1 TPAN3_2.TP v33,145
  Bottom 0.406: v33,145 54,145 55,144 55,96 54,95 6,95 5,96 5,144 6,145 30,145 31,144 53,144 54,143 54,97 53,96 7,96 6,97 6,143 7,144 29,144 30,143 52,143 53,142 53,98 52,97 8,97 7,98 7,142 8,143 v27,143
N$13
  Top 0.406: RAN4_QC.2 95,124.05 | 95,124.05 RAN4_QD.2 | CAN4_1D.1 95,111.95 | 95,111.95 CAN4_1C.1 | 95,111.95 94.95,112 CAN4_2C.2 CAN4_2D.2 94.95,124 95,124.05
N$14
  Top 0.406: RAN4_QA.2 85,124.05 | 85,124.05 RAN4_QB.2 | CAN4_1B.1 85,111.95 | 85,111.95 CAN4_1A.1 | 85,124.05 85.05,124 CAN4_2B.1 CAN4_2A.1 85.05,112 85,111.95
N$15  (via drill 0.5)
  Top 0.406: RAN4_QA.1 RAN4_QB.1 TPAN4_1.TP v87,137 | RAN4_QD.1 RAN4_QC.1 TPAN4_2.TP v93,140
  Bottom 0.406: v93,140 109,140 110,139 110,101 109,100 71,100 70,101 70,139 71,140 91,140 92,139 108,139 109,138 109,102 108,101 72,101 71,102 71,138 72,139 89.5,139 90.5,138 107,138 108,137 108,103 107,102 73,102 72,103 72,137 73,138 88,138 89,137 106,137 107,136 107,104 106,103 74,103 73,104 73,136 74,137 v87,137
N$16
  Top 0.406: CAN5_1C.1 35,171.95 | 35,171.95 CAN5_1D.1 | 35,171.95 34.95,172 CAN5_2C.2 CAN5_2D.2 35,180.05 35,184.05 | RAN5_QC.2 35,184.05 | 35,184.05 RAN5_QD.2
N$17
  Top 0.406: CAN5_1A.1 25,171.95 | 25,171.95 CAN5_1B.1 | 25,171.95 25.05,172 CAN5_2A.1 CAN5_2B.1 25.05,184 25,184.05 | RAN5_QA.2 25,184.05 | 25,184.05 RAN5_QB.2
N$19
  Top 0.406: R1B.1 C1B.2
N$21  (via drill 0.5)
  Top 0.406: RAN5_QD.1 RAN5_QC.1 TPAN5_2.TP v33,205 | RAN5_QA.1 RAN5_QB.1 TPAN5_1.TP v27,203
  Bottom 0.406: v33,205 54,205 55,204 55,156 54,155 6,155 5,156 5,204 6,205 30,205 31,204 53,204 54,203 54,157 53,156 7,156 6,157 6,203 7,204 29,204 30,203 52,203 53,202 53,158 52,157 8,157 7,158 7,202 8,203 v27,203
N$22
  Top 0.406: CAN6_1D.1 95,171.95 | 95,171.95 CAN6_1C.1 | 95,171.95 94.95,172 CAN6_2C.2 CAN6_2D.2 94.95,184 95,184.05 | RAN6_QD.2 95,184.05 | 95,184.05 RAN6_QC.2
N$23
  Top 0.406: CAN6_1B.1 85,171.95 | 85,171.95 CAN6_1A.1 | 85,171.95 85.05,172 CAN6_2A.1 CAN6_2B.1 85.05,184 85,184.05 | RAN6_QB.2 85,184.05 | 85,184.05 RAN6_QA.2
N$24  (via drill 0.5)
  Top 0.406: RAN6_QA.1 RAN6_QB.1 TPAN6_1.TP v87,203 | RAN6_QD.1 RAN6_QC.1 TPAN6_2.TP v93,205
  Bottom 0.406: v93,205 100,205 115,190 115,170 100,155 80,155 65,170 65,190 80,205 90,205 91,204 99.5,204 114,189.5 114,170.5 99.5,156 80.5,156 66,170.5 66,189.5 80.5,204 89,204 90,203 99,203 113,189 113,171 99,157 81,157 67,171 67,189 81,203 v87,203
N$26
  Top 0.305: CV2.1 7.05,12 10.5,12 12.5,14 12.77,14 U1.7
N$28
  Top 0.305: U1.9 13,12.46 CV1.1
NSS  (via drill 0.5)
  Top 0.305: U1.31 10.98,18.25 10.5,18.25 8,15.75 v8,15
  Bottom 0.305: v8,15 4.5,15 3.5,14 3.5,5 5,3.5 24.5,3.5 26,5 33,5 34,6 84,6 97,19 102.39,19 | SV3.8 102.39,19 | 102.39,19
RST  (via drill 0.5)
  Top 0.305: U1.21 16,19.35 16,20.25 v15.25,21
  Bottom 0.305: v15.25,21 9,21 7,19 4,19 1.5,16.5 1.5,4 4,1.5 37.5,1.5 38,2 93,2 94.5,3.5 94.5,5.34 SV3.2 | SV3.2
RXN  (via drill 0.5)
  Top 0.305: U1.13 17,14.35 v17,13
  Top 0.406: v20,22 20,25.95 | RV1.2 20,25.95 | C1A.1 22,25.95 20,25.95
  Bottom 0.305: v20,22 19,21 19,16.5 17,14.5 v17,13
RXP
  Top 0.305: U1.12 16.25,14.4 16.25,9.5 17.7,8.05 RV2.1
  Top 0.406: RV2.1 18.05,8 C1B.1
S1  (via drill 0.5)
  Top 0.406: U4.11 67.03,11.03 v73,17 79,17 88.5,26.5 109.26,26.5 SV3.12 | U3.11 64.53,19.02 v65,19.5
  Bottom 0.406: v73,17 69,17 66.5,19.5 v65,19.5
S2  (via drill 0.5)
  Top 0.406: U4.10 68.38,10.38 v74,16 80,16 88.5,24.5 107.66,24.5 | U3.10 64.62,18.38 v65,18 | SV3.11 107.66,24.5 | 107.66,24.5
  Bottom 0.406: v74,16 68,16 66,18 v65,18
S3  (via drill 0.5)
  Top 0.406: U4.9 69.72,9.72 v75,15 81,15 88.5,22.5 106.07,22.5 SV3.10 | U3.9 63.77,17.73 v64.5,17
  Bottom 0.406: v75,15 67,15 65,17 v64.5,17
SCK  (via drill 0.5)
  Top 0.305: U1.29 11.4,19.25 10,19.25 8.75,18 v8.25,18
  Bottom 0.305: v8.25,18 5,18 2.5,15.5 2.5,4.5 4.5,2.5 27.5,2.5 28,3 35,3 36,4 84,4 97.5,17.5 100.3,17.5 | SV3.7 100.3,17.5 | 100.3,17.5
TX1
  Top 0.305: U1.17 17.13,17.53
  Top 0.406: 17.13,17.53 17.6,18 20,18 L0A.2
TX2
  Top 0.406: U1.15 17.27,15.5 20.5,15.5 L0B.2
VMID  (via drill 0.5)
  Top 0.305: U1.14 18,14.06 v18,14 RV2.2 | RV1.1 18,22.05 20,20.05 v20,20 | CV0.1 16.25,6.1 v16.25,8
  Bottom 0.305: v20,20 20,16 v18,14 18,12.75 16.25,11 v16.25,8
XTAL1
  Top 0.305: U1.19 17,18.94 17,21.5 15.5,23 15.5,24.7 14.4,25.8 U2.P$1 12.9,27 10,27 9.95,27 9.65,27 CX1.1
XTAL2
  Top 0.305: U1.20 16.5,19.15 16.5,21 14.5,23 13.1,23 U2.P$3 9.85,24.2 CX2.1

### Text on the board
tPlace: 1.22uH / 50x50x3 / Square | ~1.1uH / 50x50x3 / Octogon | 1.22uH / 50x50x3 / Square | 1.43uH / 40x40x4 / Square | 1.22uH / 50x50x3 / Square | 1.36uH / 30x30x5 / Square
bPlace: Author: Alec Paul / 18 February, 2024 / RFID Reader Array v0.1 / MSD P18661 / Auto Chessboard / Rochester Institute of Technology
tNames: WayWayWay